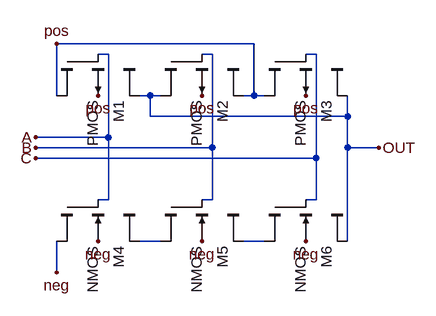
[diagram p0: schematic nand3LVS.asc]
nand3LVS.asc, the LTspice schematic file:
Version 4
SHEET 1 880 680
WIRE 352 32 48 32
WIRE 128 48 112 48
WIRE 288 48 272 48
WIRE 448 48 432 48
WIRE 48 112 48 32
WIRE 192 112 176 112
WIRE 208 112 192 112
WIRE 352 112 352 32
WIRE 352 112 336 112
WIRE 368 112 352 112
WIRE 192 144 192 112
WIRE 496 144 496 112
WIRE 496 144 192 144
WIRE 128 176 128 48
WIRE 128 176 16 176
WIRE 288 192 288 48
WIRE 288 192 16 192
WIRE 496 192 496 144
WIRE 544 192 496 192
WIRE 448 208 448 48
WIRE 448 208 16 208
WIRE 128 272 128 176
WIRE 128 272 112 272
WIRE 288 272 288 192
WIRE 288 272 272 272
WIRE 448 272 448 208
WIRE 448 272 432 272
WIRE 208 336 176 336
WIRE 368 336 336 336
WIRE 496 336 496 192
WIRE 48 384 48 336
FLAG 16 176 A
FLAG 16 192 B
FLAG 16 208 C
FLAG 544 192 OUT
FLAG 48 32 pos
FLAG 112 112 pos
FLAG 272 112 pos
FLAG 432 112 pos
FLAG 48 384 neg
FLAG 112 336 neg
FLAG 272 336 neg
FLAG 432 336 neg
SYMBOL cktsym\\pmos4 112 112 R90
SYMATTR InstName M1
SYMATTR Value2 l=.9u w=6u
SYMBOL cktsym\\pmos4 272 112 R90
SYMATTR InstName M2
SYMATTR Value2 l=.9u w=6u
SYMBOL cktsym\\pmos4 432 112 R90
SYMATTR InstName M3
SYMATTR Value2 l=.9u w=6u
SYMBOL cktsym\\nmos4 112 336 R90
SYMATTR InstName M4
SYMATTR Value2 l=.9u w=3u
SYMBOL cktsym\\nmos4 272 336 R90
SYMATTR InstName M5
SYMATTR Value2 l=.9u w=3u
SYMBOL cktsym\\nmos4 432 336 R90
SYMATTR InstName M6
SYMATTR Value2 l=.9u w=3u

The netlist it stands for:
* nand3LVS.asc
M1 pos A OUT pos PMOS l=.9u w=6u
M2 OUT B pos pos PMOS l=.9u w=6u
M3 pos C OUT pos PMOS l=.9u w=6u
M4 N001 A neg neg NMOS l=.9u w=3u
M5 N002 B N001 neg NMOS l=.9u w=3u
M6 OUT C N002 neg NMOS l=.9u w=3u
.model NMOS NMOS
.model PMOS PMOS
.lib standard.mos
.backanno
.end